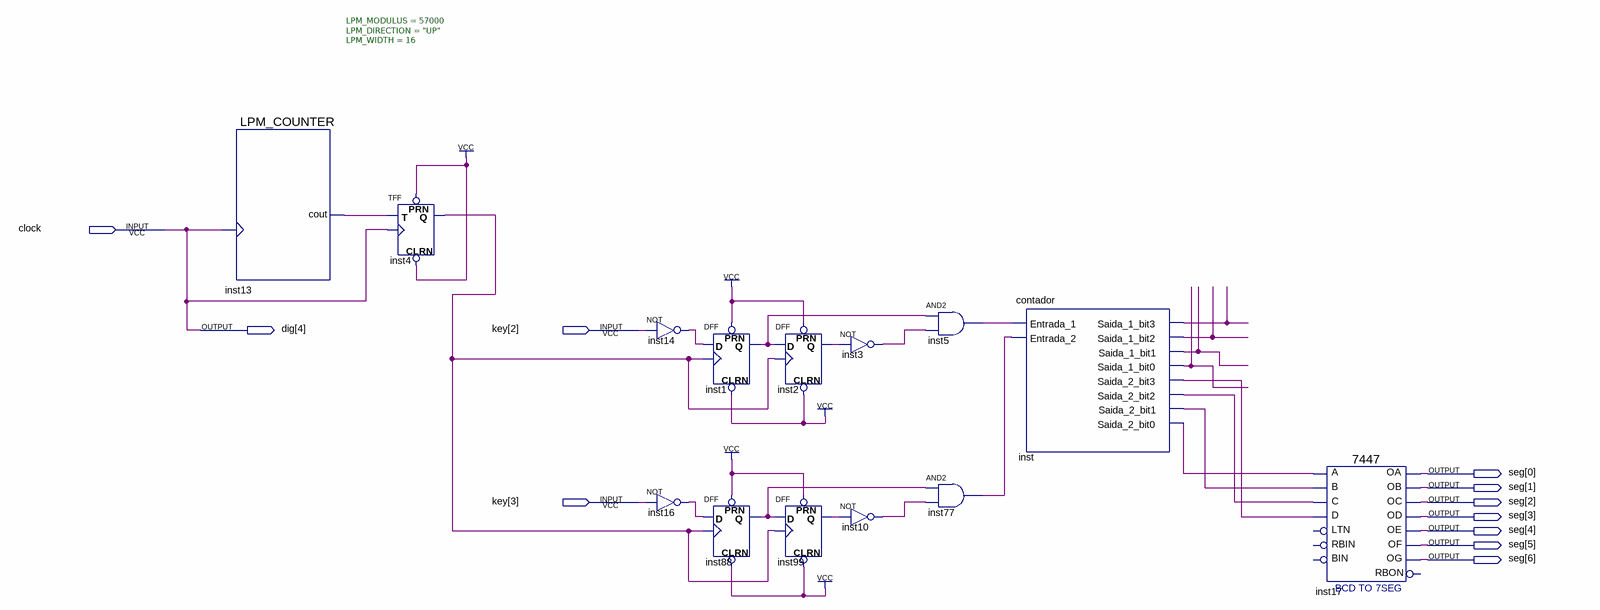
[diagram p0: schematic sheet]
// Quartus schematic teste.bdf as structural Verilog: 14 symbols, 11 pins
module teste (
  input  clock,
  input  [3:2] key,
  output [4:4] dig,
  output [6:0] seg
);

  wire inst1_q, inst2_q, inst3_out, inst4_q, inst5_out, inst10_out, inst13_cout, inst14_out, inst16_out,
       inst77_out, inst88_q, inst99_q, inst_saida_1_bit0, inst_saida_1_bit1, inst_saida_1_bit2,
       inst_saida_1_bit3, inst_saida_2_bit0, inst_saida_2_bit1, inst_saida_2_bit2, inst_saida_2_bit3;

  LPM_COUNTER #(.LPM_MODULUS(57000), .LPM_DIRECTION("UP"), .LPM_WIDTH(16)) inst13 (.clock(clock), .cout(inst13_cout));
  TFF inst4 (.PRN(1'b1), .CLRN(1'b1), .T(inst13_cout), .CLK(clock), .Q(inst4_q));
  not inst14 (inst14_out, key[2]);
  not inst16 (inst16_out, key[3]);
  DFF inst1 (.CLRN(1'b1), .CLK(inst4_q), .D(inst14_out), .PRN(1'b1), .Q(inst1_q));
  DFF inst88 (.CLRN(1'b1), .CLK(inst4_q), .D(inst16_out), .PRN(1'b1), .Q(inst88_q));
  DFF inst2 (.CLRN(1'b1), .CLK(inst4_q), .D(inst1_q), .PRN(1'b1), .Q(inst2_q));
  DFF inst99 (.CLRN(1'b1), .CLK(inst4_q), .D(inst88_q), .PRN(1'b1), .Q(inst99_q));
  not inst3 (inst3_out, inst2_q);
  not inst10 (inst10_out, inst99_q);
  and inst5 (inst5_out, inst1_q, inst3_out);
  and inst77 (inst77_out, inst88_q, inst10_out);
  contador inst (
    .Entrada_1(inst5_out), .Entrada_2(inst77_out), .Saida_1_bit3(inst_saida_1_bit3),
    .Saida_1_bit2(inst_saida_1_bit2), .Saida_1_bit1(inst_saida_1_bit1), .Saida_1_bit0(inst_saida_1_bit0),
    .Saida_2_bit3(inst_saida_2_bit3), .Saida_2_bit2(inst_saida_2_bit2), .Saida_2_bit1(inst_saida_2_bit1),
    .Saida_2_bit0(inst_saida_2_bit0));
  \7447  inst17 (
    .B(inst_saida_2_bit1), .C(inst_saida_2_bit2), .D(inst_saida_2_bit3), .A(inst_saida_2_bit0), .OB(seg[1]),
    .OC(seg[2]), .OE(seg[4]), .OD(seg[3]), .OF(seg[5]), .OG(seg[6]), .OA(seg[0]));  // open: LTN, RBIN, BIN, RBON

  assign dig[4] = clock;
endmodule
